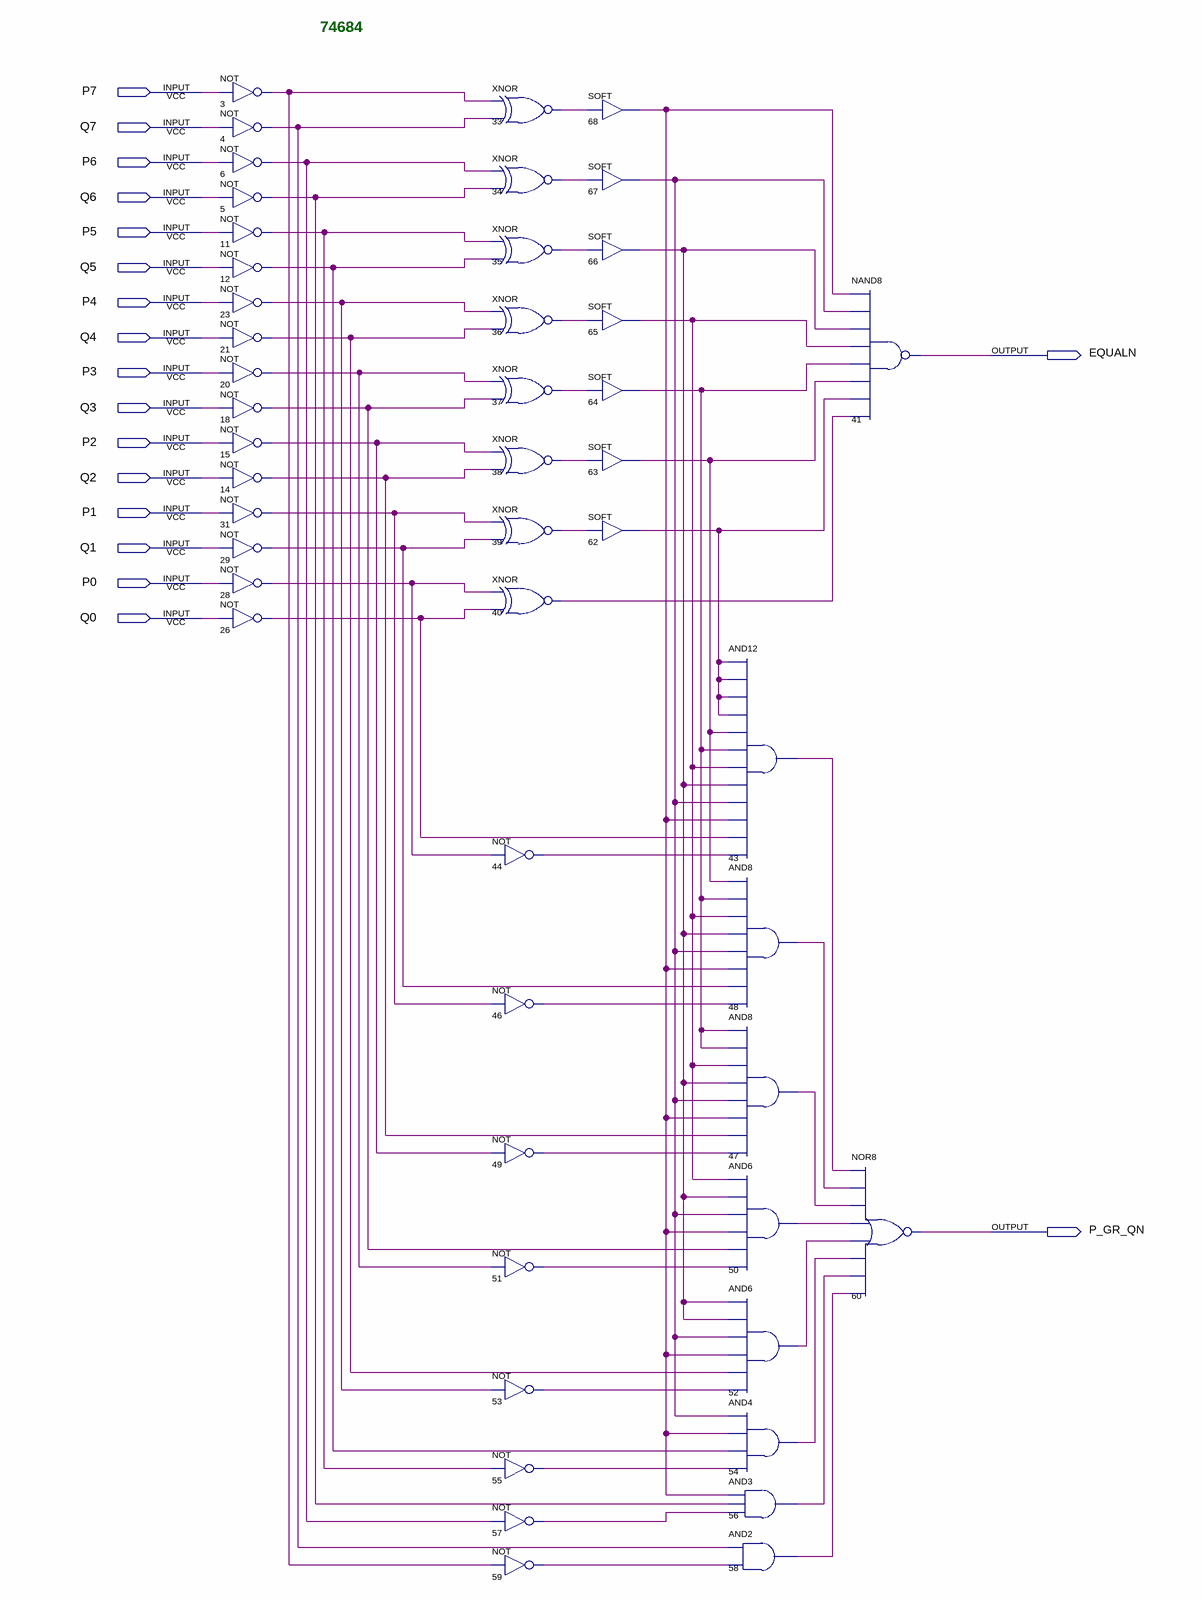
[diagram p0: schematic sheet]
// Quartus schematic 74684.bdf as structural Verilog: 49 symbols, 18 pins
module \74684  (
  input  P7,
  input  Q7,
  input  P6,
  input  Q6,
  input  P5,
  input  Q5,
  input  P4,
  input  Q4,
  input  P3,
  input  Q3,
  input  P2,
  input  Q2,
  input  P1,
  input  Q1,
  input  P0,
  input  Q0,
  output EQUALN,
  output P_GR_QN
);

  wire n3_out, n4_out, n5_out, n6_out, n11_out, n12_out, n14_out, n15_out, n18_out, n20_out, n21_out,
       n23_out, n26_out, n28_out, n29_out, n31_out, n33_out, n34_out, n35_out, n36_out, n37_out, n38_out,
       n39_out, n40_out, n43_out, n44_out, n46_out, n47_out, n48_out, n49_out, n50_out, n51_out, n52_out,
       n53_out, n54_out, n55_out, n56_out, n57_out, n58_out, n59_out, n62_out, n63_out, n64_out, n65_out,
       n66_out, n67_out, n68_out;

  not u_3 (n3_out, P7);
  not u_4 (n4_out, Q7);
  not u_6 (n6_out, P6);
  not u_5 (n5_out, Q6);
  not u_11 (n11_out, P5);
  not u_12 (n12_out, Q5);
  not u_23 (n23_out, P4);
  not u_21 (n21_out, Q4);
  not u_20 (n20_out, P3);
  not u_18 (n18_out, Q3);
  not u_15 (n15_out, P2);
  not u_14 (n14_out, Q2);
  not u_31 (n31_out, P1);
  not u_29 (n29_out, Q1);
  not u_28 (n28_out, P0);
  not u_26 (n26_out, Q0);
  xnor u_33 (n33_out, n3_out, n4_out);
  xnor u_34 (n34_out, n6_out, n5_out);
  xnor u_35 (n35_out, n11_out, n12_out);
  xnor u_36 (n36_out, n23_out, n21_out);
  xnor u_37 (n37_out, n20_out, n18_out);
  xnor u_38 (n38_out, n15_out, n14_out);
  xnor u_39 (n39_out, n31_out, n29_out);
  xnor u_40 (n40_out, n28_out, n26_out);
  not u_44 (n44_out, n28_out);
  not u_46 (n46_out, n31_out);
  not u_49 (n49_out, n15_out);
  not u_51 (n51_out, n20_out);
  not u_53 (n53_out, n23_out);
  not u_55 (n55_out, n11_out);
  not u_57 (n57_out, n6_out);
  not u_59 (n59_out, n3_out);
  SOFT u_68 (.IN(n33_out), .OUT(n68_out));
  SOFT u_67 (.IN(n34_out), .OUT(n67_out));
  SOFT u_66 (.IN(n35_out), .OUT(n66_out));
  SOFT u_65 (.IN(n36_out), .OUT(n65_out));
  SOFT u_64 (.IN(n37_out), .OUT(n64_out));
  SOFT u_63 (.IN(n38_out), .OUT(n63_out));
  SOFT u_62 (.IN(n39_out), .OUT(n62_out));
  and u_43 (n43_out, n62_out, n62_out, n62_out, n62_out, n63_out, n64_out, n65_out, n66_out, n67_out, n68_out, n26_out, n44_out);
  and u_48 (n48_out, n63_out, n64_out, n65_out, n66_out, n67_out, n68_out, n29_out, n46_out);
  and u_47 (n47_out, n64_out, n64_out, n65_out, n66_out, n67_out, n68_out, n14_out, n49_out);
  and u_50 (n50_out, n65_out, n66_out, n67_out, n68_out, n18_out, n51_out);
  and u_52 (n52_out, n66_out, n66_out, n67_out, n68_out, n21_out, n53_out);
  and u_54 (n54_out, n67_out, n68_out, n12_out, n55_out);
  and u_56 (n56_out, n68_out, n5_out, n57_out);
  and u_58 (n58_out, n4_out, n59_out);
  nand u_41 (EQUALN, n68_out, n67_out, n66_out, n65_out, n64_out, n63_out, n62_out, n40_out);
  nor u_60 (P_GR_QN, n43_out, n48_out, n47_out, n50_out, n52_out, n54_out, n56_out, n58_out);

  // Notes on the sheet:
  //   74684
endmodule
